# EAGLE design Affective_Shield (EAGLE 9.0.0)
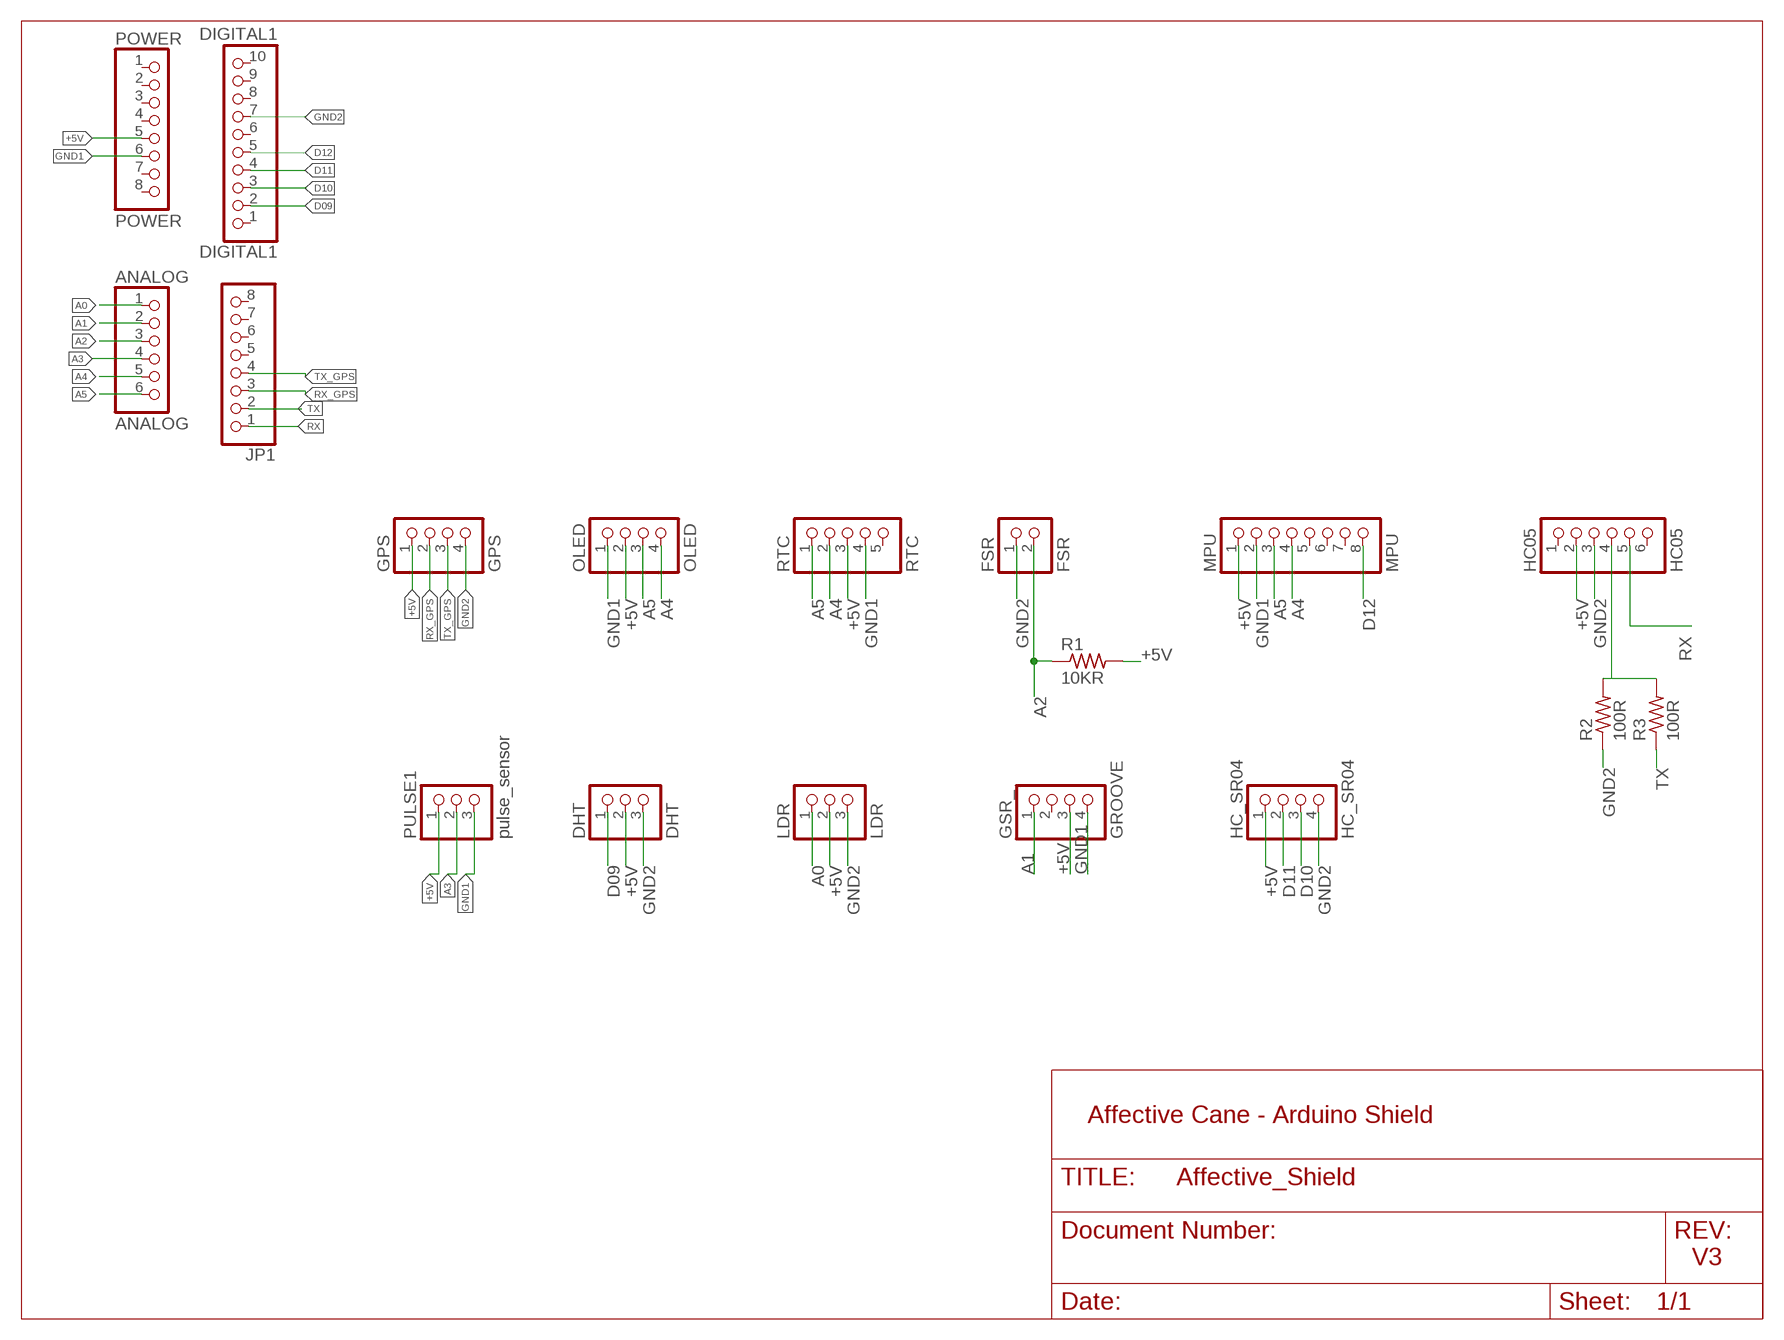
[diagram p0: schematic, sheet 1]

## Parts
ANALOG  ANALOG  PINHD-1X6  [1X06]
DHT  DHT  PINHD-1X3  [1X03]
DIGITAL1  DIGITAL1  PINHD-1X10  [1X10]
FSR  FSR  PINHD-1X2  [1X02]
GPS  GPS  PINHD-1X4  [1X04]
GSR_  GROOVE  PINHD-1X4  [1X04]
HC05  HC05  PINHD-1X6  [1X06]
HC_SR04  HC_SR04  PINHD-1X4  [1X04]
JP1  PINHD-1X8  [1X08]
LDR  LDR  PINHD-1X3  [1X03]
MPU  MPU  PINHD-1X8  [1X08]
OLED  OLED  PINHD-1X4  [1X04]
POWER  POWER  PINHD-1X8  [1X08]
PULSE1  pulse_sensor  PINHD-1X3  [1X03]
R1  10KR  R-US_0204/7  [0204/7]
R2  100R  R-US_0204/7  [0204/7]
R3  100R  R-US_0204/7  [0204/7]
RTC  RTC  PINHD-1X5  [1X05]

## Nets
+5V: DHT.2 GPS.1 GSR_.3 HC05.2 HC_SR04.1 LDR.2 MPU.1 OLED.2 POWER.5 PULSE1.1 R1.2 RTC.3
A0: ANALOG.1 LDR.1
A1: ANALOG.2 GSR_.1
A2: ANALOG.3 FSR.2 R1.1
A3: ANALOG.4 PULSE1.2
A4: ANALOG.5 MPU.4 OLED.4 RTC.2
A5: ANALOG.6 MPU.3 OLED.3 RTC.1
D09: DHT.1 DIGITAL1.2
D10: DIGITAL1.3 HC_SR04.3
D11: DIGITAL1.4 HC_SR04.2
D12: DIGITAL1.5 MPU.8
GND1: GSR_.4 MPU.2 OLED.1 POWER.6 PULSE1.3 RTC.4
GND2: DHT.3 DIGITAL1.7 FSR.1 GPS.4 HC05.3 HC_SR04.4 LDR.3 R2.1
N$3: HC05.4 R2.2 R3.2
RX: HC05.5 JP1.1
RX_GPS: GPS.2 JP1.3
TX: JP1.2 R3.1
TX_GPS: GPS.3 JP1.4
Unconnected: DIGITAL1.1 DIGITAL1.6 DIGITAL1.8 DIGITAL1.9 DIGITAL1.10 GSR_.2 HC05.1 HC05.6 JP1.5 JP1.6 JP1.7 JP1.8 MPU.5 MPU.6 MPU.7 POWER.1 POWER.2 POWER.3 POWER.4 POWER.7 POWER.8 RTC.5

## Notes on the sheet
- Affective Cane - Arduino Shield
- V3

## Library data of the parts
ANALOG HC05 = pinhead:PINHD-1X6: PIN HEADER
DHT LDR PULSE1 = pinhead:PINHD-1X3: PIN HEADER
DIGITAL1 = pinhead:PINHD-1X10: PIN HEADER
FSR = pinhead:PINHD-1X2: PIN HEADER
GPS GSR_ HC_SR04 OLED = pinhead:PINHD-1X4: PIN HEADER
JP1 MPU POWER = pinhead:PINHD-1X8: PIN HEADER
R1-R3 = resistor:R-US_: RESISTOR, American symbol
RTC = pinhead:PINHD-1X5: PIN HEADER

## Board
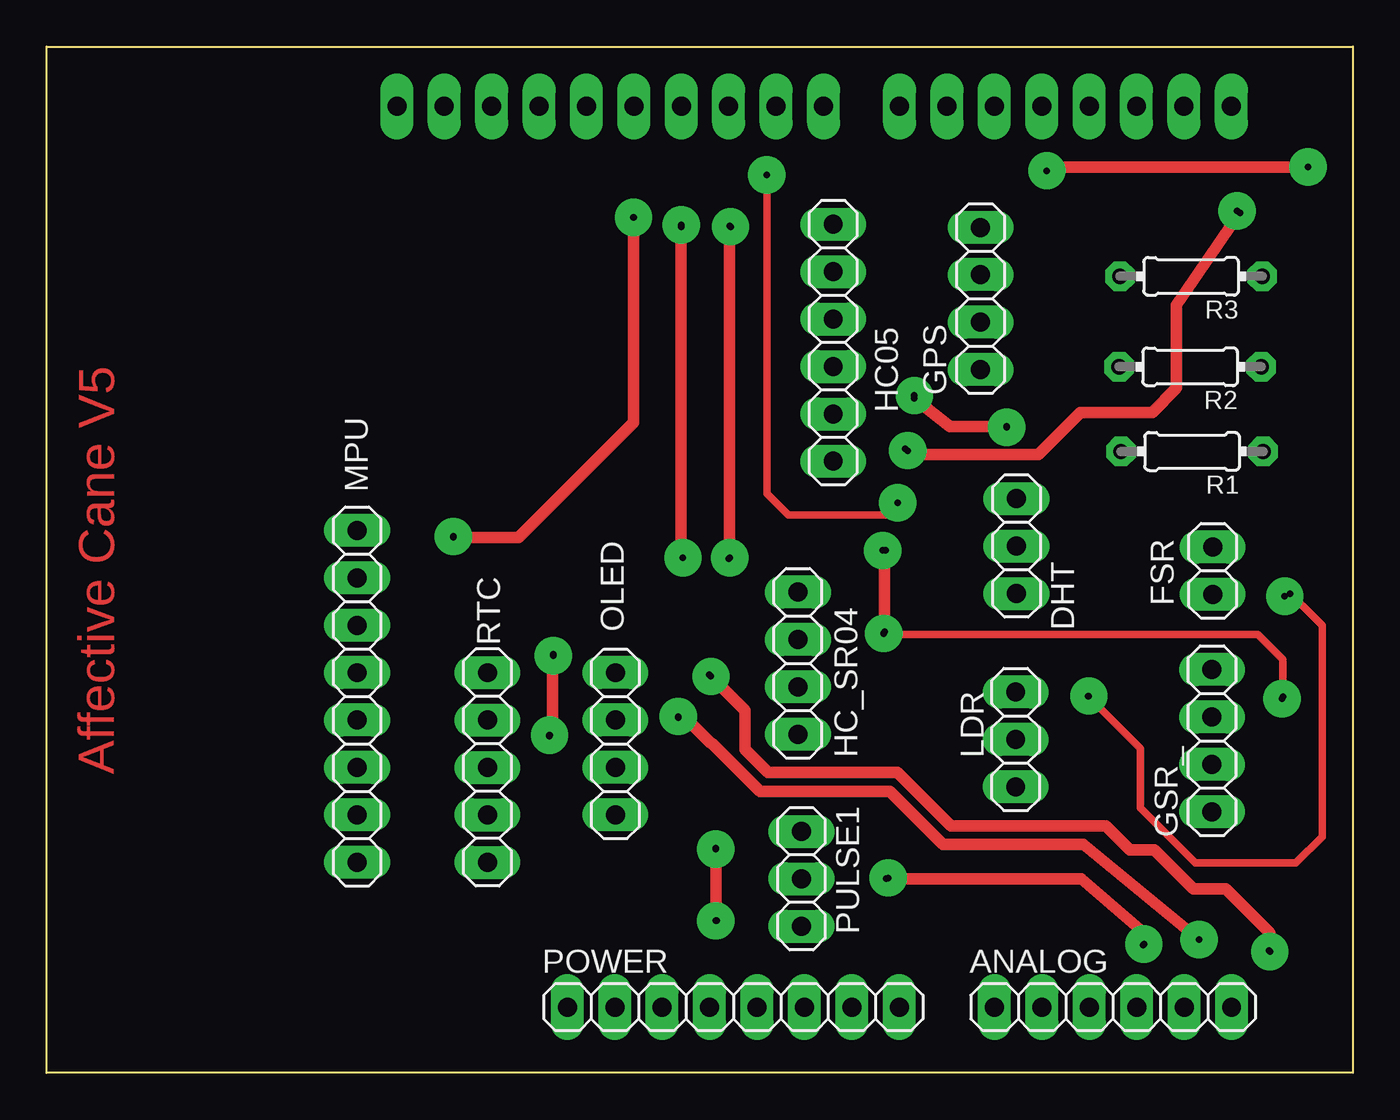
[diagram p1: board, top side]
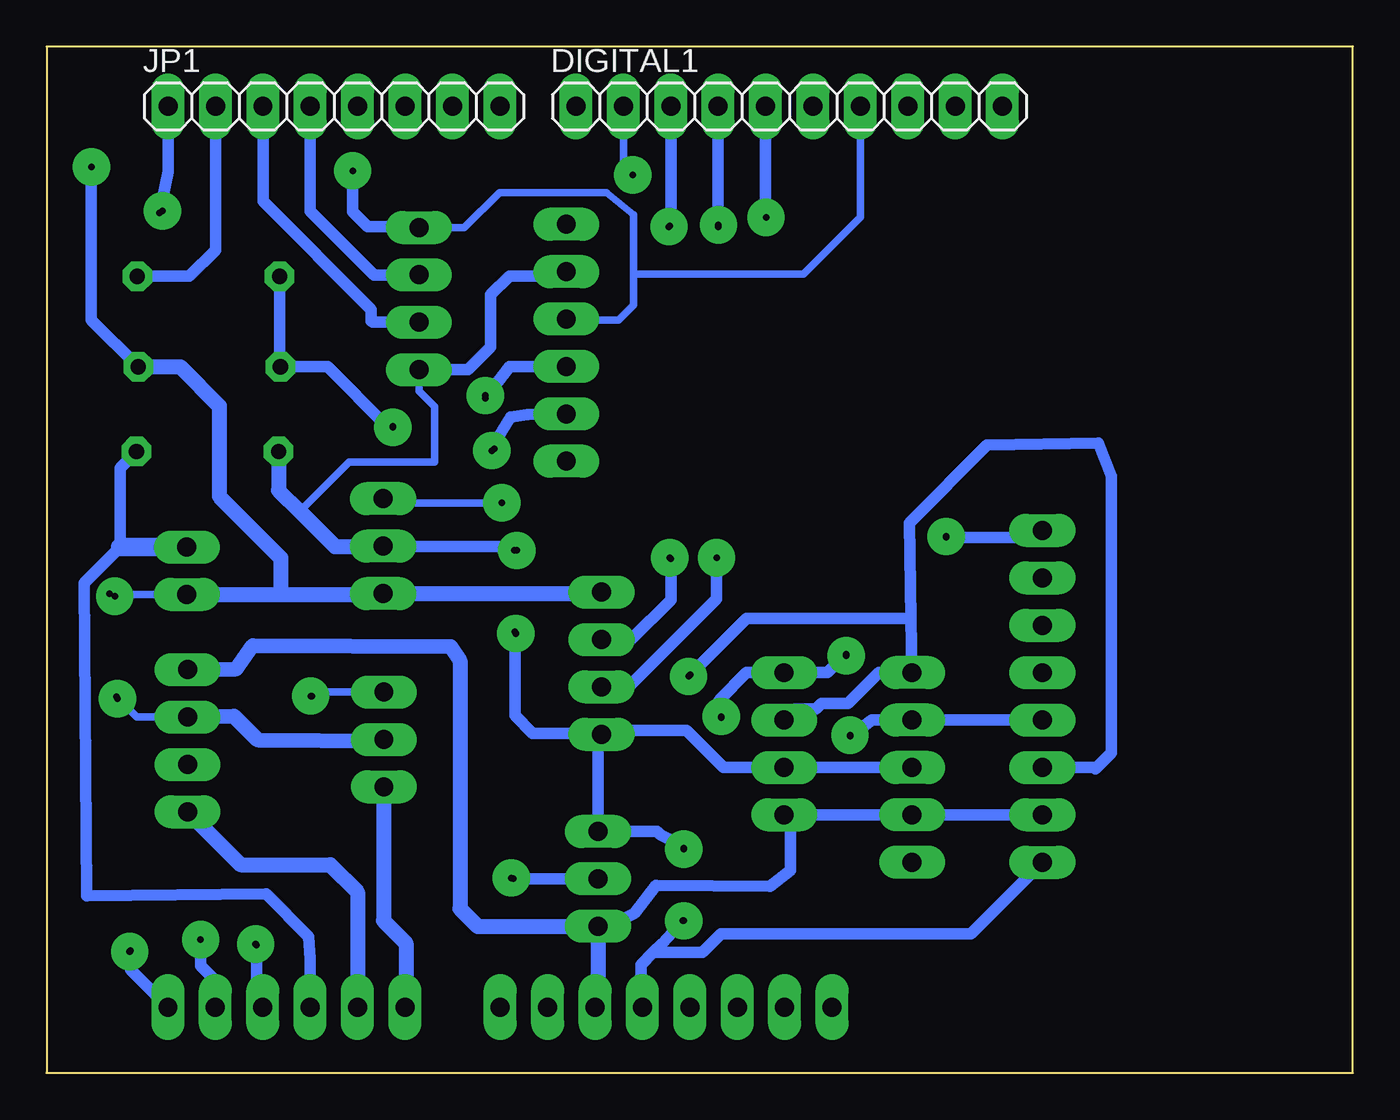
[diagram p2: board, bottom side, seen from below]

Size 70 x 55 mm. Coordinates in mm from the lower left corner, seen from the top.
Outline: 0,0 0,55 70,55 70,0 0,0
Copper layers (1*16): Top 0.035mm / dielectric 1.5mm / Bottom 0.035mm
Design rules "default *": minimum track width 15mil, minimum drill 0.5mm, track to track 16mil, track to pad 30mil, pad to pad 16mil, via to via 16mil, smd to smd 16mil, copper to edge 40mil, drill to drill 6mil, minimum pad ring 15mil, minimum via ring 8mil, stop-mask expansion 4mil, vias tented up to drill 0mil, thermal gap 10mil

### Footprints (pad centres in the part's own frame; a part is rotated, then mirrored left to right if it is on the bottom)
1X06 = drill 1.016 long: 1 -6.35,0; 2 -3.81,0; 3 -1.27,0; 4 1.27,0; 5 3.81,0; 6 6.35,0
1X03 = drill 1.016 long: 1 -2.54,0; 2 0,0; 3 2.54,0
1X10 = drill 1.016 long: 1 -11.43,0; 2 -8.89,0; 3 -6.35,0; 4 -3.81,0; 5 -1.27,0; 6 1.27,0; 7 3.81,0; 8 6.35,0; 9 8.89,0; 10 11.43,0
1X02 = drill 1.016 long: 1 -1.27,0; 2 1.27,0
1X04 = drill 1.016 long: 1 -3.81,0; 2 -1.27,0; 3 1.27,0; 4 3.81,0
1X08 = drill 1.016 long: 1 -8.89,0; 2 -6.35,0; 3 -3.81,0; 4 -1.27,0; 5 1.27,0; 6 3.81,0; 7 6.35,0; 8 8.89,0
0204/7 = drill 0.813 octagon: 1 -3.81,0; 2 3.81,0
1X05 = drill 1.016 long: 1 -5.08,0; 2 -2.54,0; 3 0,0; 4 2.54,0; 5 5.08,0

### Placement (x,y rotation side)
ANALOG  57.15,3.52 0 top
DHT  51.97,28.23 270 top
DIGITAL1  30.2,51.8 0 bottom
FSR  62.49,26.91 90 top
GPS  50.05,41.5 90 top
GSR_  62.45,17.8 90 top
HC05  42.15,39.13 270 top
HC_SR04  40.26,21.95 90 top
JP1  54.6,51.8 0 bottom
LDR  51.93,17.87 90 top
MPU  16.64,20.18 90 top
OLED  30.48,17.64 90 top
POWER  36.8,3.52 0 top
PULSE1  40.45,10.4 270 top
R1  61.38,33.3 180 top
R2  61.28,37.84 180 top
R3  61.33,42.69 180 top
RTC  23.62,16.37 270 top

### Tracks (layer width: path | path; a pad name or v marks a point on that pad's centre or on a via)
+5V  (via drill 0.35 pad 1.3)
  Top 0.406: v66.25,20.15 66.25,22.15 64.9,23.5 45.05,23.5 v44.9,23.65
  Top 0.61: v44.9,23.65 44.9,27.95 v44.95,28 | v35.85,12.05 v35.9,8.15
  Bottom 0.406: GSR_.3 65.17,19.07 v66.25,20.15 | GPS.1 50.05,36.55 49.2,35.7 49.2,32.75 53.8,32.75 56.42,30.12 56.42,30.07
  Bottom 0.61: DHT.2 52,28.2 45.15,28.2 v44.95,28 | 40.45,17.95 PULSE1.1 37.29,12.94 37.1,12.75 36,12.2 v35.85,12.05 | 40.45,17.95 HC_SR04.1 40.2,18.2 | RTC.3 OLED.2 33.72,16.37 35.7,18.35 40.05,18.35 40.2,18.2 | POWER.5 38.15,3.6 38.15,5.8 37.5,6.45 | 40.55,17.85 40.45,17.95 | 40.2,18.2 43.95,18.2 44.9,19.15 v44.9,23.65 | v35.9,8.15 37,6.95 37.5,6.45 | MPU.1 20.47,7.45 33.85,7.45 34.85,6.45 37.5,6.45 | HC05.2 42.39,42.7 45.2,42.7 46.2,41.7 46.2,38.9 47.41,37.69 GPS.1
  Bottom 0.813: GSR_.3 59.97,19.12 58.7,17.85 52,17.8 LDR.2 | R1.2 57.57,31.22 56.42,30.07 54.55,28.2 52,28.2
A0
  Bottom 0.813: LDR.1 arc-90 51.95,15.31 51.95,8.15 50.75,6.95 50.75,3.55
  Bottom 1: 50.75,3.55 ANALOG.1
A1
  Bottom 0.813: GSR_.1 59.61,11.15 54.8,11.15 53.34,9.69 ANALOG.2
A2
  Bottom 0.61: R1.1 66.07,32.42 66.07,28.18 68,26.25 67.85,9.5 58.25,9.6 55.95,7.3 55.88,6.12 ANALOG.3
  Bottom 1: 66.07,28.18 FSR.2
A3  (via drill 0.35 pad 1.3)
  Top 0.61: v45,10.4 55.45,10.4 58.76,7.54 v58.76,6.84
  Bottom 0.61: PULSE1.2 44.75,10.4 44.85,10.3 44.9,10.3 v45,10.4 | v58.76,6.84 58.71,3.82 ANALOG.4
A4  (via drill 0.35 pad 1.3, 0.35 pad 2)
  Top 0.61: v61.75,7.15 55.57,12.23 48.03,12.23 45.18,15.08 38.23,15.08 35.66,17.65 35.6,17.65 34.45,18.8 v33.85,19.05 | v26.94,18.04 v26.95,18.1 27.1,18 27.1,21.35 v27.15,22.45
  Bottom 0.61: MPU.4 RTC.2 25.77,18.91 v26.94,18.04 | 30.78,21.55 30.58,21.35 OLED.4 | OLED.4 32.5,21.45 33.95,20 v33.85,19.1 v33.85,19.05 | v61.75,7.15 61.75,5.75 60.96,4.96 ANALOG.5 | v27.15,22.45 28.15,21.45 OLED.4
A5  (via drill 0.35 pad 1.3, 0.35 pad 2)
  Top 0.61: v35.5,21.35 v35.6,21.25 37.41,19.44 37.41,17.34 38.65,16.1 45.6,16.1 48.45,13.25 56.75,13.25 58.05,11.95 59.35,11.95 61.45,9.85 63.2,9.85 65.55,7.5 65.55,6.6 v65.5,6.55
  Bottom 0.406: 13.87,16.37 13.8,16.3
  Bottom 0.61: 35.4,21.45 v35.5,21.35 32.49,24.36 23.68,24.36 | RTC.1 | RTC.1 23.68,24.36 | 23.68,24.36 23.77,29.48 19.6,33.65 13.65,33.75 12.95,32 12.95,17.15 13.8,16.3 | v65.5,6.55 65.5,5.53 ANALOG.6 | MPU.3 13.87,16.37 | RTC.1 25.4,21.45 27.05,19.8 28.47,19.8 28.78,19.49 29.9,19.49 OLED.3
D09  (via drill 0.35 pad 2)
  Top 0.406: v38.59,48.12 38.59,31.06 39.75,29.9 44.95,29.9 v45.6,30.55
  Bottom 0.406: DIGITAL1.2 39.09,48.62 v38.59,48.12 | v45.6,30.55 51.75,30.55 DHT.1
D10  (via drill 0.35 pad 1.3, 0.35 pad 2)
  Top 0.61: v36.6,45.4 v36.6,27.6 v36.55,27.55
  Bottom 0.61: DIGITAL1.3 36.55,45.45 v36.6,45.4 | v36.55,27.55 36.55,25.35 38.67,23.23 HC_SR04.3
D11  (via drill 0.35 pad 1.3, 0.35 pad 2)
  Top 0.61: v34,45.35 34,27.7 v34.1,27.6
  Bottom 0.61: DIGITAL1.4 v34.01,45.36 v34,45.35 | HC_SR04.2 38.81,20.68 34.1,25.4 v34.1,27.6
D12  (via drill 0.35 pad 1.3, 0.35 pad 2)
  Top 0.61: v31.45,45.85 31.45,34.85 25.3,28.7 v21.8,28.7
  Bottom 0.61: DIGITAL1.5 31.47,45.87 v31.45,45.85 | v21.8,28.7 17,28.7 MPU.8
GND1
  Bottom 0.61: MPU.2 RTC.4 30.15,13.83 | 30.15,13.83 OLED.1 30.55,13.76 | PULSE1.3 39.97,7.79 38.5,8.54 37.34,10.05 31.25,10 30.15,10.85 30.15,13.83
  Bottom 0.813: PULSE1.3 40.45,7.8 | 40.45,7.8 40.45,3.69 POWER.6 | GSR_.4 59.84,21.66 58.95,22.9 48.35,22.85 47.85,22.1 47.85,8.8 46.9,7.85 40.5,7.85 40.45,7.8
GND2  (via drill 0.35 pad 1.3, 0.35 pad 2)
  Top 0.406: v55.8,20.2 58.6,17.4 58.6,14.2 61.55,11.25 66.95,11.25 68.35,12.65 68.35,23.98 v66.64,25.69
  Top 0.61: v53.6,48.35 53.8,48.55 v67.6,48.55
  Bottom 0.406: 40.3,25.72 40.33,25.69 | LDR.3 55.59,20.41 v55.8,20.2 | v66.64,25.69 66.59,25.64 FSR.1 | GPS.4 47.64,45.31 45.72,47.18 39.98,47.18 38.55,46 38.55,42.8 | HC05.3 42.1,40.35 39.35,40.35 38.55,41.15 38.55,42.8 | DIGITAL1.7 26.39,45.86 29.45,42.8 38.55,42.8
  Bottom 0.61: GPS.4 50.09,45.35 52.8,45.35 53.6,46.15 v53.6,48.35 | R2.1 67.6,40.35 v67.6,48.55
  Bottom 0.813: FSR.1 57.45,25.64 | 57.45,25.64 52.02,25.64 DHT.3 40.33,25.69 HC_SR04.4 | R2.1 62.84,37.84 60.75,35.75 60.75,30.9 57.45,27.6 57.45,25.64
N$1  (via drill 0.35 pad 2)
  other vias: 34,45.45
N$2  (via drill 0.35 pad 2)
  other vias: 36.65,45.35
N$3  (via drill 0.35 pad 1.3)
  Top 0.61: v51.45,34.65 48.4,34.65 v46.5,36.15
  Bottom 0.61: R3.2 57.52,37.89 R2.2 54.94,37.84 51.75,34.65 v51.45,34.65 | v46.5,36.15 45.19,37.86 HC05.4
N$5  (via drill 0.35 pad 2)
  other vias: 21.8,28.75
N$6  (via drill 0.35 pad 2)
  other vias: 27.15,22.35
N$7  (via drill 0.35 pad 2)
  other vias: 44.85,23.55
N$8  (via drill 0.35 pad 2)
  other vias: 44.8,28
N$9  (via drill 0.35 pad 2)
  other vias: 66.35,25.55
N$10  (via drill 0.35 pad 2)
  other vias: 66.2,20.05
N$11  (via drill 0.35 pad 2)
  other vias: 55.85,20.2
N$12  (via drill 0.35 pad 2)
  other vias: 65.55,6.5
N$13  (via drill 0.35 pad 2)
  other vias: 58.8,6.9
N$14  (via drill 0.35 pad 2)
  other vias: 35.85,8.15
N$15  (via drill 0.35 pad 2)
  other vias: 35.85,12
N$16  (via drill 0.35 pad 2)
  other vias: 45.1,10.45
N$17  (via drill 0.35 pad 2)
  other vias: 46.15,33.35
N$18  (via drill 0.35 pad 2)
  other vias: 46.5,36.3
N$19  (via drill 0.35 pad 2)
  other vias: 51.45,34.6
N$20  (via drill 0.35 pad 2)
  other vias: 63.8,46.2
RX  (via drill 0.35 pad 1.3)
  Top 0.61: v63.95,46.1 60.55,41.15 60.55,36.7 59.25,35.4 55.4,35.4 53.15,33.15 46.45,33.15 v46,33.45
  Bottom 0.61: JP1.1 63.49,48.31 v63.95,46.1 | v46,33.45 46,33.75 45.15,35.15 44.23,35.27 HC05.5
RX_GPS
  Bottom 0.61: JP1.3 58.41,46.71 52.6,40.9 52.6,40.3 52.53,40.23 GPS.2
TX
  Bottom 0.61: JP1.2 60.95,44.1 62.36,42.69 R3.1
TX_GPS
  Bottom 0.61: JP1.4 55.87,46.17 52.45,42.75 50.07,42.75 GPS.3

### Text on the board
Top: Affective Cane V5